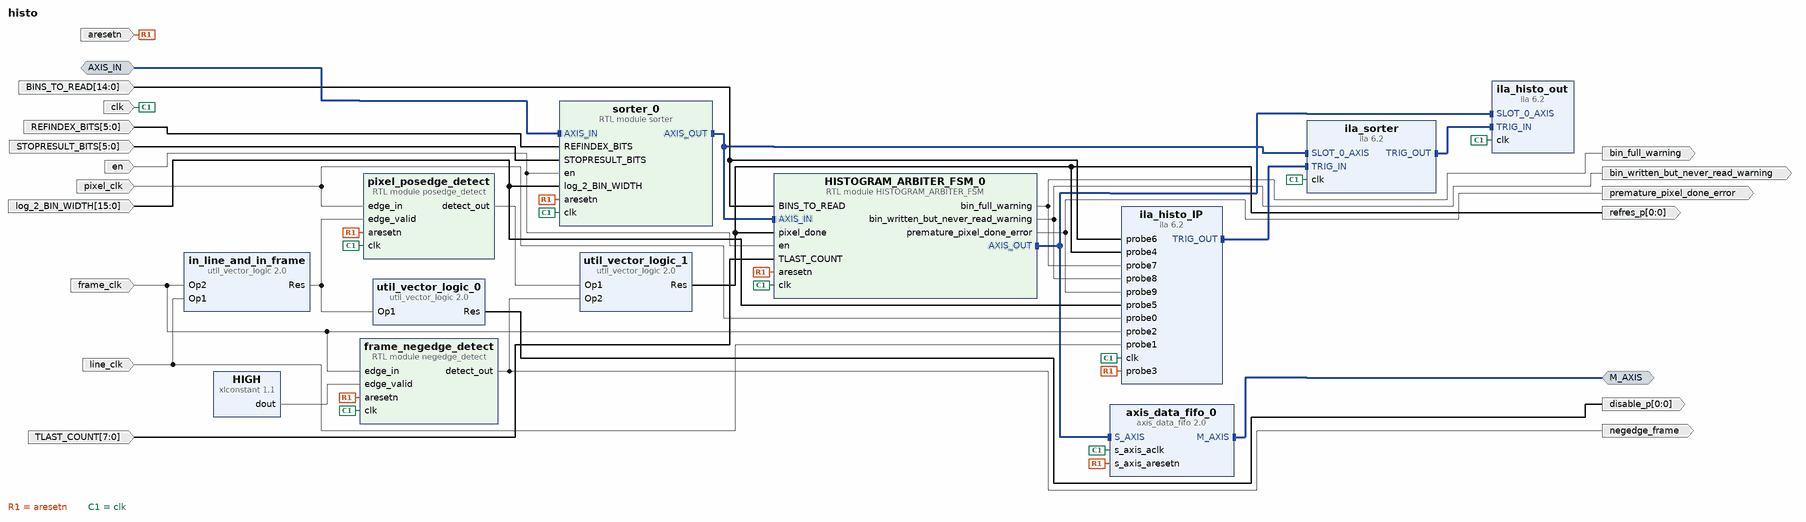
[diagram p0: block diagram of the top level]
# Vivado block design histo, xc7z020clg484-1, Vivado 2024.2
create_bd_design histo

create_bd_intf_port -mode Slave -vlnv xilinx.com:interface:axis_rtl:1.0 AXIS_IN
set_property -dict [list \
  CONFIG.HAS_TKEEP 0 \
  CONFIG.HAS_TLAST 1 \
  CONFIG.HAS_TREADY 1 \
  CONFIG.HAS_TSTRB 0 \
  CONFIG.LAYERED_METADATA undef \
  CONFIG.TDATA_NUM_BYTES 8 \
  CONFIG.TDEST_WIDTH 0 \
  CONFIG.TID_WIDTH 0 \
  CONFIG.TUSER_WIDTH 0 \
] [get_bd_intf_ports AXIS_IN]
create_bd_intf_port -mode Master -vlnv xilinx.com:interface:axis_rtl:1.0 M_AXIS
create_bd_port -dir I -type rst aresetn
create_bd_port -dir I -type clk clk
set_property -dict {CONFIG.ASSOCIATED_BUSIF AXIS_IN:M_AXIS CONFIG.ASSOCIATED_RESET aresetn} [get_bd_ports clk]
create_bd_port -dir O -from 0 -to 0 disable_p
create_bd_port -dir I en
create_bd_port -dir I frame_clk
create_bd_port -dir I line_clk
create_bd_port -dir I pixel_clk
create_bd_port -dir O -from 0 -to 0 refres_p
create_bd_port -dir O -type intr negedge_frame
create_bd_port -dir I -from 7 -to 0 TLAST_COUNT
create_bd_port -dir O bin_full_warning
create_bd_port -dir O premature_pixel_done_error
create_bd_port -dir I -from 5 -to 0 REFINDEX_BITS
create_bd_port -dir I -from 5 -to 0 STOPRESULT_BITS
create_bd_port -dir I -from 15 -to 0 log_2_BIN_WIDTH
create_bd_port -dir I -from 14 -to 0 BINS_TO_READ
create_bd_port -dir O bin_written_but_never_read_warning

create_bd_cell -type ip -vlnv xilinx.com:ip:axis_data_fifo:2.0 axis_data_fifo_0
set_property -dict {CONFIG.FIFO_MEMORY_TYPE auto} [get_bd_cells axis_data_fifo_0]
create_bd_cell -type ip -vlnv xilinx.com:ip:util_vector_logic:2.0 in_line_and_in_frame
set_property -dict {CONFIG.C_SIZE 1} [get_bd_cells in_line_and_in_frame]
create_bd_cell -type ip -vlnv xilinx.com:ip:util_vector_logic:2.0 util_vector_logic_0
set_property -dict {CONFIG.C_OPERATION not CONFIG.C_SIZE 1} [get_bd_cells util_vector_logic_0]
create_bd_cell -type ip -vlnv xilinx.com:ip:util_vector_logic:2.0 util_vector_logic_1
set_property -dict {CONFIG.C_OPERATION or CONFIG.C_SIZE 1} [get_bd_cells util_vector_logic_1]
create_bd_cell -type module -reference HISTOGRAM_ARBITER_FSM HISTOGRAM_ARBITER_FSM_0
set_property -dict {CONFIG.HIST_BINS 16384} [get_bd_cells HISTOGRAM_ARBITER_FSM_0]
create_bd_cell -type module -reference sorter sorter_0
create_bd_cell -type module -reference negedge_detect frame_negedge_detect
create_bd_cell -type ip -vlnv xilinx.com:ip:xlconstant:1.1 HIGH
create_bd_cell -type module -reference posedge_detect pixel_posedge_detect
create_bd_cell -type ip -vlnv xilinx.com:ip:ila:6.2 ila_sorter
set_property -dict [list \
  CONFIG.C_DATA_DEPTH 4096 \
  CONFIG.C_SLOT_0_AXIS_TDATA_WIDTH 64 \
  CONFIG.C_SLOT_0_AXI_PROTOCOL AXI4S \
  CONFIG.C_TRIGIN_EN true \
  CONFIG.C_TRIGOUT_EN true \
] [get_bd_cells ila_sorter]
create_bd_cell -type ip -vlnv xilinx.com:ip:ila:6.2 ila_histo_IP
set_property -dict [list \
  CONFIG.C_DATA_DEPTH 4096 \
  CONFIG.C_MONITOR_TYPE Native \
  CONFIG.C_NUM_OF_PROBES 10 \
  CONFIG.C_PROBE5_WIDTH 16 \
  CONFIG.C_PROBE6_WIDTH 15 \
  CONFIG.C_TRIGOUT_EN true \
] [get_bd_cells ila_histo_IP]
create_bd_cell -type ip -vlnv xilinx.com:ip:ila:6.2 ila_histo_out
set_property -dict [list \
  CONFIG.C_DATA_DEPTH 4096 \
  CONFIG.C_SLOT_0_AXIS_TDATA_WIDTH 64 \
  CONFIG.C_SLOT_0_AXI_PROTOCOL AXI4S \
  CONFIG.C_TRIGIN_EN true \
  CONFIG.C_TRIGOUT_EN false \
] [get_bd_cells ila_histo_out]

# ---- connections ----

connect_bd_intf_net [get_bd_intf_ports AXIS_IN] [get_bd_intf_pins sorter_0/AXIS_IN]
connect_bd_intf_net [get_bd_intf_pins HISTOGRAM_ARBITER_FSM_0/AXIS_OUT] [get_bd_intf_pins axis_data_fifo_0/S_AXIS]
connect_bd_intf_net [get_bd_intf_pins HISTOGRAM_ARBITER_FSM_0/AXIS_OUT] [get_bd_intf_pins ila_histo_out/SLOT_0_AXIS]
connect_bd_intf_net [get_bd_intf_ports M_AXIS] [get_bd_intf_pins axis_data_fifo_0/M_AXIS]
connect_bd_intf_net [get_bd_intf_pins ila_histo_IP/TRIG_OUT] [get_bd_intf_pins ila_sorter/TRIG_IN]
connect_bd_intf_net [get_bd_intf_pins ila_sorter/TRIG_OUT] [get_bd_intf_pins ila_histo_out/TRIG_IN]
connect_bd_intf_net [get_bd_intf_pins sorter_0/AXIS_OUT] [get_bd_intf_pins HISTOGRAM_ARBITER_FSM_0/AXIS_IN]
connect_bd_intf_net [get_bd_intf_pins sorter_0/AXIS_OUT] [get_bd_intf_pins ila_sorter/SLOT_0_AXIS]
connect_bd_net -net BINS_READ_1 [get_bd_ports BINS_TO_READ] [get_bd_pins HISTOGRAM_ARBITER_FSM_0/BINS_TO_READ] [get_bd_pins ila_histo_IP/probe6]
connect_bd_net [get_bd_pins HISTOGRAM_ARBITER_FSM_0/bin_full_warning] [get_bd_ports bin_full_warning] [get_bd_pins ila_histo_IP/probe7]
connect_bd_net [get_bd_pins HISTOGRAM_ARBITER_FSM_0/bin_written_but_never_read_warning] \
  [get_bd_ports bin_written_but_never_read_warning] [get_bd_pins ila_histo_IP/probe8]
connect_bd_net [get_bd_pins HISTOGRAM_ARBITER_FSM_0/premature_pixel_done_error] \
  [get_bd_ports premature_pixel_done_error] [get_bd_pins ila_histo_IP/probe9]
connect_bd_net -net MSGLEN_0_1 [get_bd_ports TLAST_COUNT] [get_bd_pins HISTOGRAM_ARBITER_FSM_0/TLAST_COUNT]
connect_bd_net -net REFINDEX_BITS_0_1 [get_bd_ports REFINDEX_BITS] [get_bd_pins sorter_0/REFINDEX_BITS]
connect_bd_net -net STOPRESULT_BITS_0_1 [get_bd_ports STOPRESULT_BITS] [get_bd_pins sorter_0/STOPRESULT_BITS]
connect_bd_net -net aresetn_0_1 [get_bd_ports aresetn] \
  [get_bd_pins axis_data_fifo_0/s_axis_aresetn] [get_bd_pins pixel_posedge_detect/aresetn] \
  [get_bd_pins frame_negedge_detect/aresetn] [get_bd_pins sorter_0/aresetn] [get_bd_pins HISTOGRAM_ARBITER_FSM_0/aresetn] \
  [get_bd_pins ila_histo_IP/probe3]
connect_bd_net -net clk_0_1 [get_bd_ports clk] \
  [get_bd_pins axis_data_fifo_0/s_axis_aclk] [get_bd_pins pixel_posedge_detect/clk] [get_bd_pins frame_negedge_detect/clk] \
  [get_bd_pins sorter_0/clk] [get_bd_pins ila_sorter/clk] [get_bd_pins HISTOGRAM_ARBITER_FSM_0/clk] \
  [get_bd_pins ila_histo_IP/clk] [get_bd_pins ila_histo_out/clk]
connect_bd_net -net edge_detect_0_detect_out [get_bd_pins util_vector_logic_1/Res] \
  [get_bd_ports refres_p] [get_bd_pins HISTOGRAM_ARBITER_FSM_0/pixel_done] [get_bd_pins ila_histo_IP/probe4]
connect_bd_net -net en_0_1 [get_bd_ports en] [get_bd_pins sorter_0/en] [get_bd_pins HISTOGRAM_ARBITER_FSM_0/en]
connect_bd_net [get_bd_ports frame_clk] \
  [get_bd_pins in_line_and_in_frame/Op2] [get_bd_pins frame_negedge_detect/edge_in] [get_bd_pins ila_histo_IP/probe2]
connect_bd_net -net frame_clk_edge_detect1_detect_out [get_bd_pins frame_negedge_detect/detect_out] \
  [get_bd_pins util_vector_logic_1/Op2] [get_bd_ports negedge_frame]
connect_bd_net [get_bd_pins in_line_and_in_frame/Res] [get_bd_pins util_vector_logic_0/Op1] [get_bd_pins pixel_posedge_detect/edge_valid]
connect_bd_net [get_bd_ports line_clk] [get_bd_pins in_line_and_in_frame/Op1] [get_bd_pins ila_histo_IP/probe1]
connect_bd_net -net log_2_BIN_WIDTH_0_1 [get_bd_ports log_2_BIN_WIDTH] [get_bd_pins sorter_0/log_2_BIN_WIDTH] [get_bd_pins ila_histo_IP/probe5]
connect_bd_net [get_bd_ports pixel_clk] [get_bd_pins pixel_posedge_detect/edge_in] [get_bd_pins ila_histo_IP/probe0]
connect_bd_net [get_bd_pins pixel_posedge_detect/detect_out] [get_bd_pins util_vector_logic_1/Op1]
connect_bd_net [get_bd_pins util_vector_logic_0/Res] [get_bd_ports disable_p]
connect_bd_net -net xlconstant_0_dout [get_bd_pins HIGH/dout] [get_bd_pins frame_negedge_detect/edge_valid]

validate_bd_design
save_bd_design
